# Altium schematic sheet Relay_Driver.SchDoc
size B
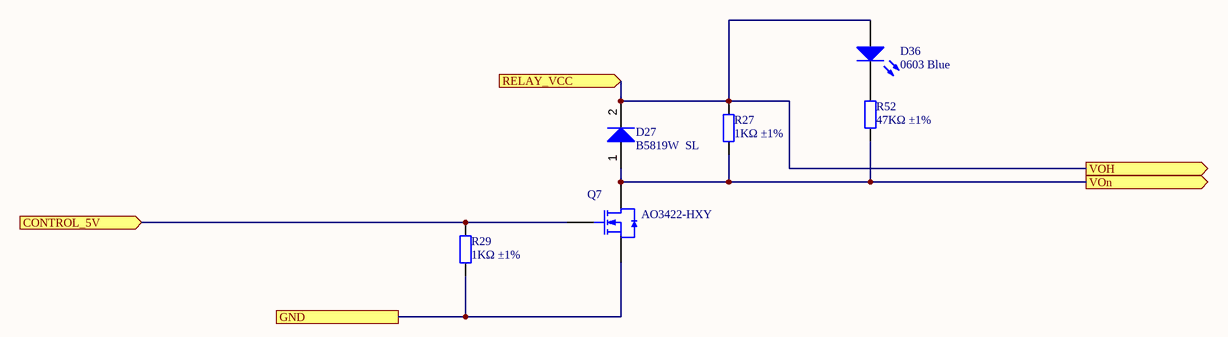
[diagram p0: Relay_Driver.SchDoc]

## Parts
D27  B5819W  SL  [SOD-123]
D36  0603 Blue  [0603_LED_S1]
Q7  AO3422-HXY  [SOT-23-3L]
R27  1KΩ ±1%  [0603_R]
R29  1KΩ ±1%  [0603_R]
R52  47KΩ ±1%  [0603_R]

## Ports
CONTROL_5V (in), GND, RELAY_VCC (in), VOH (out), VOn (out)

## Nets
CONTROL_5V: Q7.1(G) R29.2 ; port CONTROL_5V
GND: Q7.2(S) R29.1 ; port GND
RELAY_VCC: D27.2(K) D36.A R27.2 ; port RELAY_VCC, port VOH
VOn: D27.1(A) Q7.3(D) R27.1 R52.1 ; port VOn
NetD36_K: D36.K R52.2

## Notes on the sheet
- SHEET
- Expatria Technologies
- 1136 Glade Court
- Port Coquitlam, BC V3B 1R5
- PROJECT
- SIZE
- ENGR
- MODIFIED
- DOCUMENT
- REV
- Copyright Expatria Technologies 2023. This document describes Open Hardware and is licensed under the CERN-OHL-S v2. No warranty is implied or expressed.
- EMAIL: INFO@EXPATRIA.CA
- B
- /

## Library data of the parts
D27 = SOD-123 B5819W  SL: Schottky Diode; ComponentLink1Description: 供应商链接; ComponentLink1URL: http://www.szlcsc.com/product/details_9093.html; Package: SOD-123; Supplier: LC; SuppliersPartNumber: C8598
D36 = 0603 LED Blue: LED; ComponentLink1Description: 供应商链接; ComponentLink1URL: http://www.szlcsc.com/product/details_73150.html; Package: 0603; Supplier: LC; SuppliersPartNumber: C72041; Color: Blue
Q7 = AO3400A N道沟 X0YV1T SOT-23: 60V 4.5A 8W 75mΩ@10V,5A 2.5V@250uA N Channel 695pF@15V SOT-23-3L MOSFETs ROHS; ComponentLink1Description: 供应商链接; ComponentLink1URL: http://www.szlcsc.com/product/details_21629.html; Package: SOT-23L; Supplier: LC; SuppliersPartNumber: C4748727
R27 R29 = 0603 1K (1001) 1%: Chip resistor; Manufacturer: Uniroyal Elec; PartNumber: 0603WAF1001T5E; Power: 1/10W; ComponentLink1Description: Supplier link; ComponentLink1URL: http://www.szlcsc.com/product/details_21904.html; Package: 0603; Supplier: LC; SuppliersPartNumber: C21190; Resistance: 1KΩ; Tolerance: 1%
R52 = 0603 47K (4702) 1%: Chip resistor; Manufacturer: Uniroyal Elec; PartNumber: 0603WAF4702T5E; Power: 1/10W; ComponentLink1Description: Supplier link; ComponentLink1URL: http://www.szlcsc.com/product/details_26562.html; Package: 0603; Supplier: LC; SuppliersPartNumber: C25819; Resistance: 47KΩ; Tolerance: 1%